# Altium project Driver.PrjPcb
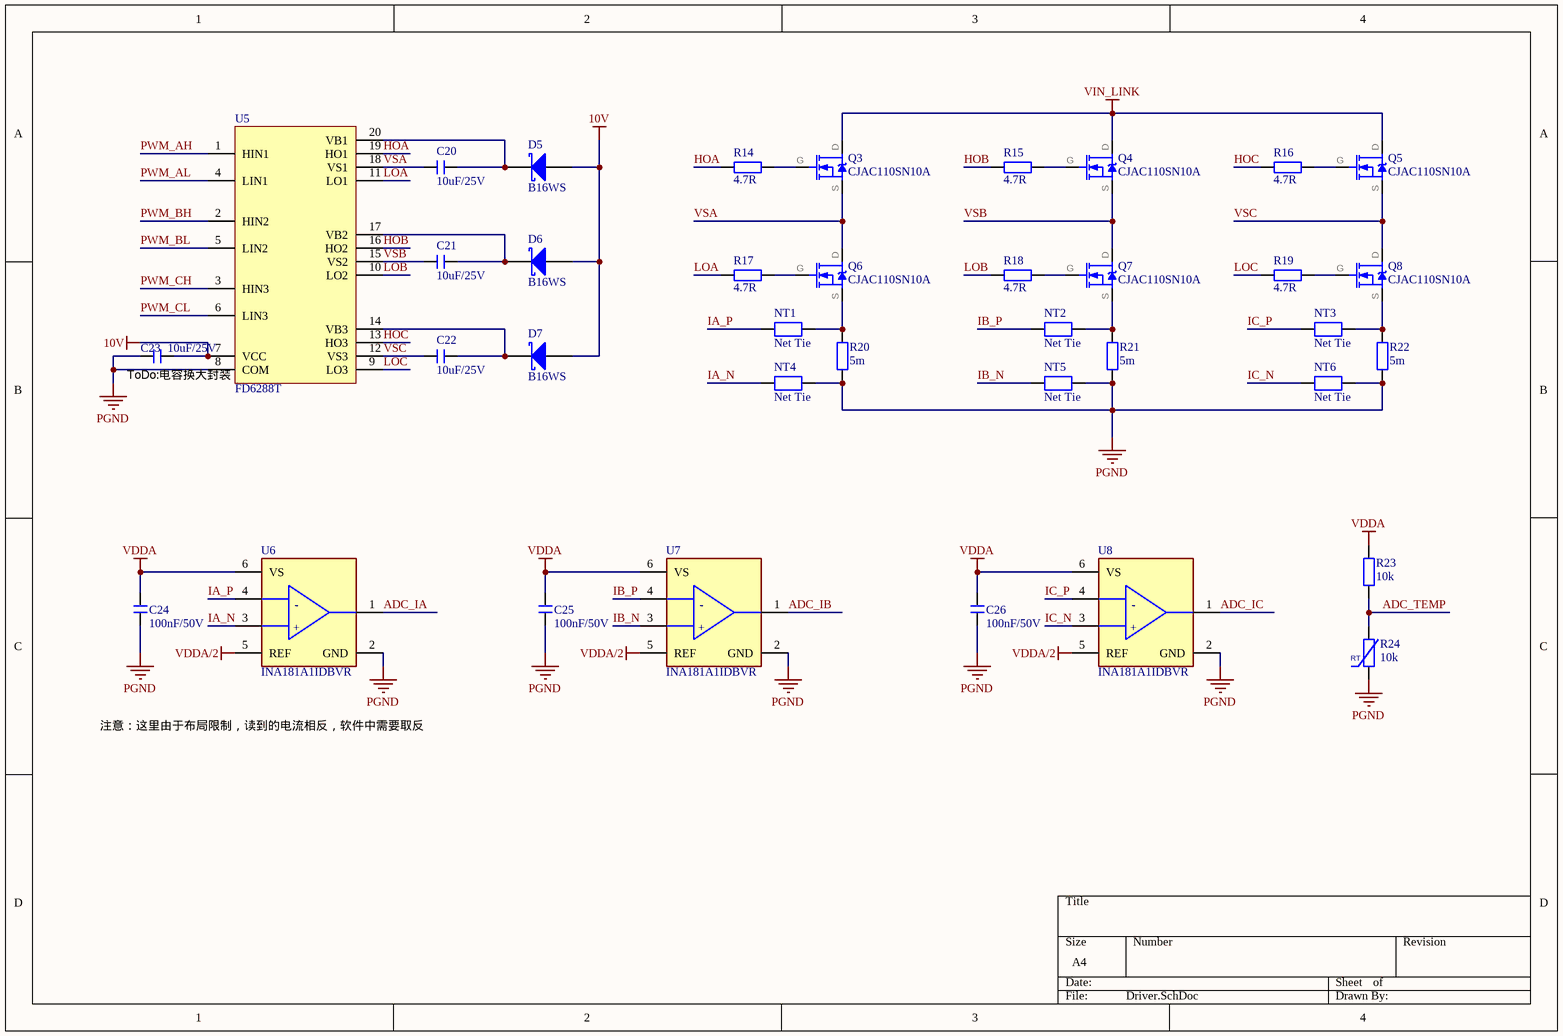
[diagram p0: Driver.SchDoc]
3 sheets, 93 parts. Net scope: global (net labels, ports and power ports of the same name join across sheets).
Board file: Driver.PcbDoc
Sheets:
  Driver.SchDoc
  Power.SchDoc
  Interface.SchDoc

## Sheet Driver.SchDoc
size A4; SheetNumber: 1; SheetTotal: 3

### Parts
C20  10uF/25V  [Capacitor_0603_SMD]
C21  10uF/25V  [Capacitor_0603_SMD]
C22  10uF/25V  [Capacitor_0603_SMD]
C23  10uF/25V  [Capacitor_0603_SMD]
C24  100nF/50V  [Capacitor_0402_SMD]
C25  100nF/50V  [Capacitor_0402_SMD]
C26  100nF/50V  [Capacitor_0402_SMD]
D5  B16WS  [SOD-323]
D6  B16WS  [SOD-323]
D7  B16WS  [SOD-323]
NT1  Net Tie  [Net Tie 10mil]  (net tie, no BOM)
NT2  Net Tie  [Net Tie 10mil]  (net tie, no BOM)
NT3  Net Tie  [Net Tie 10mil]  (net tie, no BOM)
NT4  Net Tie  [Net Tie 10mil]  (net tie, no BOM)
NT5  Net Tie  [Net Tie 10mil]  (net tie, no BOM)
NT6  Net Tie  [Net Tie 10mil]  (net tie, no BOM)
Q3  CJAC110SN10A  [PDFNWB5×6-8L]
Q4  CJAC110SN10A  [PDFNWB5×6-8L]
Q5  CJAC110SN10A  [PDFNWB5×6-8L]
Q6  CJAC110SN10A  [PDFNWB5×6-8L]
Q7  CJAC110SN10A  [PDFNWB5×6-8L]
Q8  CJAC110SN10A  [PDFNWB5×6-8L]
R14  4.7R  [Resistor_0603_SMD]
R15  4.7R  [Resistor_0603_SMD]
R16  4.7R  [Resistor_0603_SMD]
R17  4.7R  [Resistor_0603_SMD]
R18  4.7R  [Resistor_0603_SMD]
R19  4.7R  [Resistor_0603_SMD]
R20  5m  [Resistor_2512_SMD]
R21  5m  [Resistor_2512_SMD]
R22  5m  [Resistor_2512_SMD]
R23  10k  [Resistor_0402_SMD]
R24  10k  [Resistor_0402_SMD]
U5  FD6288T  [TSSOP20_L]
U6  INA181A1IDBVR  [FP-DBV0006A-IPC_A]
U7  INA181A1IDBVR  [FP-DBV0006A-IPC_A]
U8  INA181A1IDBVR  [FP-DBV0006A-IPC_A]

### Nets
10V: C23.2 D5.1(A) D6.1(A) D7.1(A) U5.7(VCC)
PGND: C23.1 C24.1 C25.1 C26.1 NT4.2 NT5.2 NT6.2 R20.1 R21.1 R22.1 R24.1 U5.8(COM) U6.2(GND) U7.2(GND) U8.2(GND)
VDDA: C24.2 C25.2 C26.2 R23.2 U6.6(VS) U7.6(VS) U8.6(VS)
VDDA/2: U6.5(REF) U7.5(REF) U8.5(REF)
VIN_LINK: Q3.D Q4.D Q5.D
ADC_IA: U6.1(OUT)
ADC_IB: U7.1(OUT)
ADC_IC: U8.1(OUT)
ADC_TEMP: R23.1 R24.2
HOA: R14.2 U5.19(HO1)
HOB: R15.2 U5.16(HO2)
HOC: R16.2 U5.13(HO3)
IA_N: NT4.1 U6.3(IN+)
IA_P: NT1.1 U6.4(IN-)
IB_N: NT5.1 U7.3(IN+)
IB_P: NT2.1 U7.4(IN-)
IC_N: NT6.1 U8.3(IN+)
IC_P: NT3.1 U8.4(IN-)
LOA: R17.2 U5.11(LO1)
LOB: R18.2 U5.10(LO2)
LOC: R19.2 U5.9(LO3)
PWM_AH: U5.1(HIN1)
PWM_AL: U5.4(LIN1)
PWM_BH: U5.2(HIN2)
PWM_BL: U5.5(LIN2)
PWM_CH: U5.3(HIN3)
PWM_CL: U5.6(LIN3)
VSA: C20.1 Q3.S Q6.D U5.18(VS1)
VSB: C21.1 Q4.S Q7.D U5.15(VS2)
VSC: C22.1 Q5.S Q8.D U5.12(VS3)
NetC20_2: C20.2 D5.2(K) U5.20(VB1)
NetC21_2: C21.2 D6.2(K) U5.17(VB2)
NetC22_2: C22.2 D7.2(K) U5.14(VB3)
NetNT1_2: NT1.2 Q6.S R20.2
NetNT2_2: NT2.2 Q7.S R21.2
NetNT3_2: NT3.2 Q8.S R22.2
NetQ3_G: Q3.G R14.1
NetQ4_G: Q4.G R15.1
NetQ5_G: Q5.G R16.1
NetQ6_G: Q6.G R17.1
NetQ7_G: Q7.G R18.1
NetQ8_G: Q8.G R19.1

### Notes on the sheet
- (near C23) ToDo:电容换大封装
- 注意：这里由于布局限制，读到的电流相反，软件中需要取反
- (in symbol CMP-04895-000055-1) -; +

### Library data of the parts
C20-C26 = C: 无极性贴片电容; 版权归属: 源创客; BOM名称: 无极性贴片电容; 学习资源: www.ooocke.com
D5-D7 = SS14: 肖特基二极管; 属性: 40V/1A; 联系卖家，免费查找封装: 唯一出售店铺网址https://shop463601444.taobao.com; BOM名称: 肖特基二极管
Q3-Q8 = CJAC110SN10A: 110A 3.4mΩ@10V N-Channel Power MOSFET
R14-R22 = R: 贴片电阻; 版权归属: 源创客; BOM名称: 贴片电阻; 学习资源: www.ooocke.com
R23 = R: 贴片电阻; 联系卖家，免费查找封装: 唯一出售店铺网址https://shop463601444.taobao.com; BOM名称: 贴片电阻
R24 = RT: 热敏电阻; BOM名称: 压敏电阻; 联系卖家，免费查找封装: 唯一出售店铺网址https://shop463601444.taobao.com
U5 = FD6288T: 三相250V栅极驱动器
U6-U8 = CMP-04895-000055-1: IC CURR SENSE 1 CIRCUIT SOT23-6; Manufacturer: Texas Instruments; Input Offset Voltage: 0.1mV; Min Supply Voltage: 2.7V; Max Junction Temp: +150°C; Voltage Gain: 0.02V/mV; Number Of Channels: 1; Standoff Height: 0mm; Input Bias Current: 75uA; Nominal Supply Current: 195uA; Bandwidth: 350kHz; Output Current Per Channel: 8mA; Max Supply Voltage: 5.5V; Device Class L1: Integrated Circuits (ICs); Ambient Temperature Range High: +125°C; Device Class L3: Instrumentation; Temperature: -40°C to +125°C; ComponentLink2Description: Datasheet; RoHS: TRUE; Category: IC; Manufacturer Part Number: INA181A1IDBVR; Mouser Description: 26V bi-directional current sense amplifier for cost-sensitive systems 6-SOT-23 -40 to 125; Package: DBV0006A; Automotive: No; Height: 1.45mm; Temperature Range Low: -40°C; Lead Free: Yes; Device Class L2: Linear ICs; Digikey Description: IC CURR SENSE 1 CIRCUIT SOT23-6; ComponentLink2URL: http://www.ti.com/lit/ds/symlink/ina181.pdf; Ambient Temperature Range Low: -40°C; Octopart: https://octopart.com/ina181a1idbvr-texas+instruments-81856289; Temperature Range High: +125°C

## Sheet Power.SchDoc
size A4; SheetNumber: 2; SheetTotal: 3
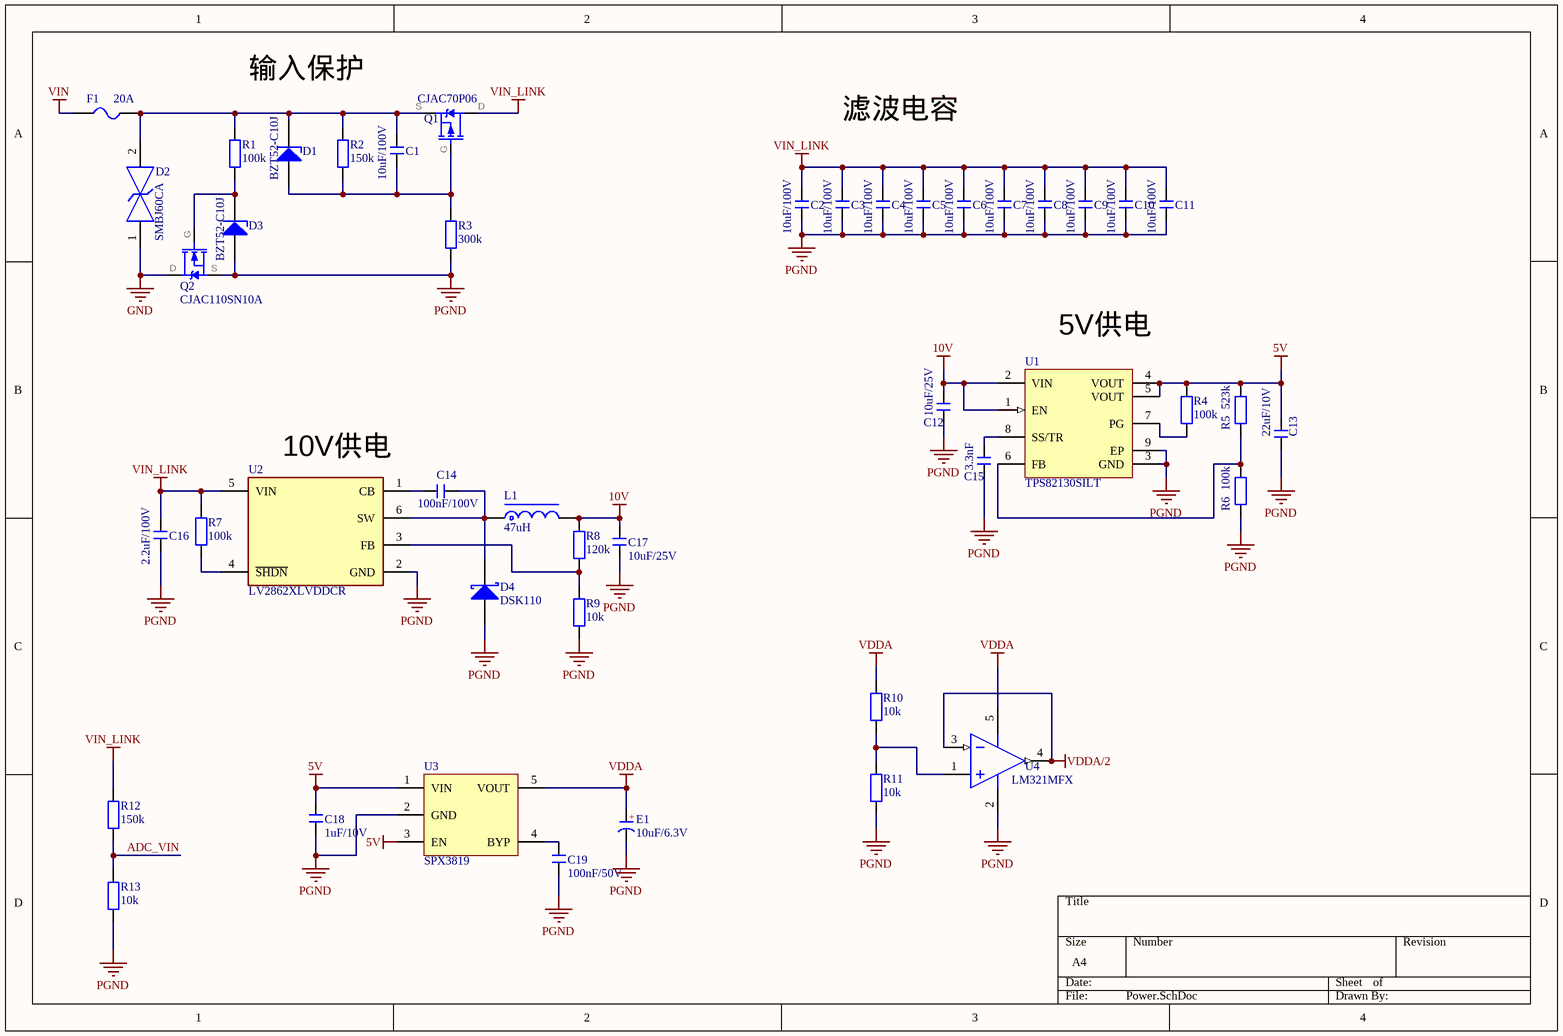
[diagram p1: Power.SchDoc]

### Parts
C1  10uF/100V  [Capacitor_1206_SMD]
C2  10uF/100V  [Capacitor_1206_SMD]
C3  10uF/100V  [Capacitor_1206_SMD]
C4  10uF/100V  [Capacitor_1206_SMD]
C5  10uF/100V  [Capacitor_1206_SMD]
C6  10uF/100V  [Capacitor_1206_SMD]
C7  10uF/100V  [Capacitor_1206_SMD]
C8  10uF/100V  [Capacitor_1206_SMD]
C9  10uF/100V  [Capacitor_1206_SMD]
C10  10uF/100V  [Capacitor_1206_SMD]
C11  10uF/100V  [Capacitor_1206_SMD]
C12  10uF/25V  [Capacitor_0603_SMD]
C13  22uF/10V  [Capacitor_0603_SMD]
C14  100nF/100V  [Capacitor_0603_SMD]
C15  3.3nF  [Capacitor_0402_SMD]
C16  2.2uF/100V  [Capacitor_1206_SMD]
C17  10uF/25V  [Capacitor_0603_SMD]
C18  1uF/10V  [Capacitor_0402_SMD]
C19  100nF/50V  [Capacitor_0402_SMD]
D1  BZT52-C10J  [SOD-123FL]
D2  SMBJ60CA  [FP-SMBJ-CA-MFG]
D3  BZT52-C10J  [SOD-123FL]
D4  DSK110  [SOD-123FL]
E1  10uF/6.3V  [Tantalum_Capacitor_0805_SMD]
F1  20A  [FU 1808]
L1  47uH  [Molded_Inductor_0530]
Q1  CJAC70P06  [PDFNWB5×6-8L]
Q2  CJAC110SN10A  [PDFNWB5×6-8L]
R1  100k  [Resistor_0402_SMD]
R2  150k  [Resistor_0402_SMD]
R3  300k  [Resistor_0402_SMD]
R4  100k  [Resistor_0402_SMD]
R5  523k  [Resistor_0402_SMD]
R6  100k  [Resistor_0402_SMD]
R7  100k  [Resistor_0402_SMD]
R8  120k  [Resistor_0402_SMD]
R9  10k  [Resistor_0402_SMD]
R10  10k  [Resistor_0402_SMD]
R11  10k  [Resistor_0402_SMD]
R12  150k  [Resistor_0402_SMD]
R13  10k  [Resistor_0402_SMD]
U1  TPS82130SILT  [SIL0008D_V]
U2  LV2862XLVDDCR  [FP-DDC0006A-MFG]
U3  SPX3819  [SOT23-5L]
U4  LM321MFX  [DBV0005A_L]

### Nets
5V: C13.2 C18.2 R4.2 R5.2 U1.4(VOUT) U1.5(VOUT) U3.1(VIN) U3.3(EN)
10V: C12.1 C17.1 L1.2 R8.2 U1.1(EN) U1.2(VIN)
GND: D2.1 Q2.D
PGND: C2.1 C3.1 C4.1 C5.1 C6.1 C7.1 C8.1 C9.1 C10.1 C11.1 C12.2 C13.1 C15.1 C16.2 C17.2 C18.1 C19.1 D3.1(A) D4.1(A) E1.2(K) Q2.S R3.1 R6.1 R9.2 R11.2 R13.1 U1.3(GND) U1.9(EP) U2.2(GND) U3.2(GND) U4.2(V-)
VDDA: E1.1(A) R10.1 U3.5(VOUT) U4.5(V+)
VDDA/2: U4.3(IN-) U4.4(OUT)
VIN: F1.1
VIN_LINK: C2.2 C3.2 C4.2 C5.2 C6.2 C7.2 C8.2 C9.2 C10.2 C11.2 C16.1 Q1.D R7.2 R12.2 U2.5(VIN)
ADC_VIN: R12.1 R13.2
NetC1_1: C1.1 D1.1(A) Q1.G R2.1 R3.2
NetC1_2: C1.2 D1.2(K) D2.2 F1.2 Q1.S R1.2 R2.2
NetC14_1: C14.1 U2.1(CB)
NetC14_2: C14.2 D4.2(K) L1.1 U2.6(SW)
NetC15_2: C15.2 U1.8(SS/TR)
NetC19_2: C19.2 U3.4(BYP)
NetD3_2: D3.2(K) Q2.G R1.1
NetR4_1: R4.1 U1.7(PG)
NetR5_1: R5.1 R6.2 U1.6(FB)
NetR7_1: R7.1 U2.4(~{SHDN})
NetR8_1: R8.1 R9.1 U2.3(FB)
NetR10_2: R10.2 R11.1 U4.1(IN+)

### Notes on the sheet
- 输入保护
- 滤波电容
- (near U1) 5V供电
- (near U2) 10V供电
- (in symbol C-CD) +

### Library data of the parts
C1-C19 = C: 无极性贴片电容; 版权归属: 源创客; BOM名称: 无极性贴片电容; 学习资源: www.ooocke.com
D1 D3 = 稳压二极管: Zener Diode; 联系卖家，免费查找封装: 唯一出售店铺网址https://shop463601444.taobao.com
D2 = CMP-08607-000060-1: TVS DIODE 60V DO214AA; Manufacturer Part Number: SMBJ48CA; Manufacturer: Littelfuse Inc; Number Of Channels: 1; Peak Pulse Current: 7.8A; Max Junction Temp: +150°C; Clamping Voltage: 77.4V; Breakdown Voltage: 53.3V; Direction: Bidirectional; Peak Pulse Power: 600W; Reverse Standoff Voltage: 48V; Temperature: -65°C to +150°C; ComponentLink2Description: Datasheet; Height: 2.61mm; ComponentLink2URL: https://www.littelfuse.com/~/media/electronics/datasheets/tvs_diodes/littelfuse_tvs_diode_smbj_datasheet.pdf.pdf; Temperature Range Low: -65°C; Automotive: No; RoHS: TRUE; Device Class L3: unset; Mouser Description: In a Pack of 25, Littelfuse SMBJ48CA, Bi-Directional TVS Diode, 600W, 2-Pin DO-214AA; Temperature Range High: +150°C; Octopart: https://octopart.com/smbj48ca-littelfuse-350748; Lead Free: Yes; Device Class L2: TVS Diodes; Digikey Description: TVS DIODE 48V 77.4V DO214AA; Device Class L1: Circuit Protection; Category: Diode; Package: SMBJ-CA
D4 = SS14: as D5 on sheet Driver; BOM名称: 肖特基二极管
E1 = C-CD: 贴片钽电容; 版权归属: 源创客; BOM名称: 贴片钽电容; 学习资源: www.ooocke.com
F1 = FU: 贴片保险丝; 版权归属: 源创客; BOM名称: 贴片保险丝; 学习资源: www.ooocke.com
L1 = L-CD: 贴片功率电感; BOM名称: 功率电感; 版权归属: 源创客; 学习资源: www.ooocke.com
Q1 = CJAC70P06: -70A 7.6mΩ@-10V P-Channel Power MOSFET
Q2 = CJAC110SN10A: 110A 3.4mΩ@10V N-Channel Power MOSFET
R1-R4 R6-R13 = R: 贴片电阻; 版权归属: 源创客; BOM名称: 贴片电阻; 学习资源: www.ooocke.com
R5 = R: 贴片电阻
U1 = CMP-2000-07569-1: Step-Down Converter MicroSiP(TM) Module with Integrated Inductor, 3 A, 3 to 17 V, -40 to 125 degC, 8-Pin uSiP (SIL), Tape and Reel; Manufacturer: Texas Instruments; Quiescent Current: 20uA; Output Voltage: 5V; Output Current: 3A; Max Input Voltage: 17V; Switching Frequency: 2MHz; Min Output Voltage: 900mV; Number of Outputs: 1; Min Input Voltage: 3V; Datasheet URL: http://www.ti.com/lit/ds/symlink/tps82130.pdf; Packaging: CutTape; Datasheet Version: Rev. C, 01/2017; Package Reference: SIL0008D; Case/Package: SMD/SMT; Manufacturer URL: http://www.ti.com/; Length: 0.12inch; Lead Free: LeadFree; Mount: SurfaceMount; Number of Pins: 8; Package Description: 8-Pin Single In-line Package, Body 3 x 2.8 mm, Pitch 0.65 mm; Max Output Voltage: 5V; Mounting Technology: SurfaceMount; Height: 0.06inch; Max Operating Temperature: 125degC; Width: 0.11inch; Min Operating Temperature: -40degC; Voltage - Output 1: 5V; RoHSCompliant: True; REACH SVHC: NoSVHC; Max Output Current: 3A
U2 = CMP-04918-000583-1: Switching Voltage Regulators 4.5-V to 60-V, 600-mA buck converter in ultra-small SOT23 package 6-SOT-23-THIN -40 to 125
U3 = SPX3819: 500mA Low-Noise LDO Voltage Regulator
U4 = CMP-0055-01337-3: Low Power Single Op Amp, 5-pin SOT-23; Manufacturer: Texas Instruments; PowerWise: N; CompType: Amplifiers; PackageTopMarking: A63A*XTT; ComponentLink1Description: Datasheet URL; PackageDescription: Molded SOT-23, .115 x .063 x .040 in Body, 5 Lead, .0375 in Pitch; PinCount: 5; ComponentLink1URL: http://www.ti.com/general/docs/lit/getliterature.tsp?genericPartNumber=LM321&fileType=pdf; RoHS: N; Package Reference: DBV0005A

## Sheet Interface.SchDoc
size A4; SheetNumber: 3; SheetTotal: 3
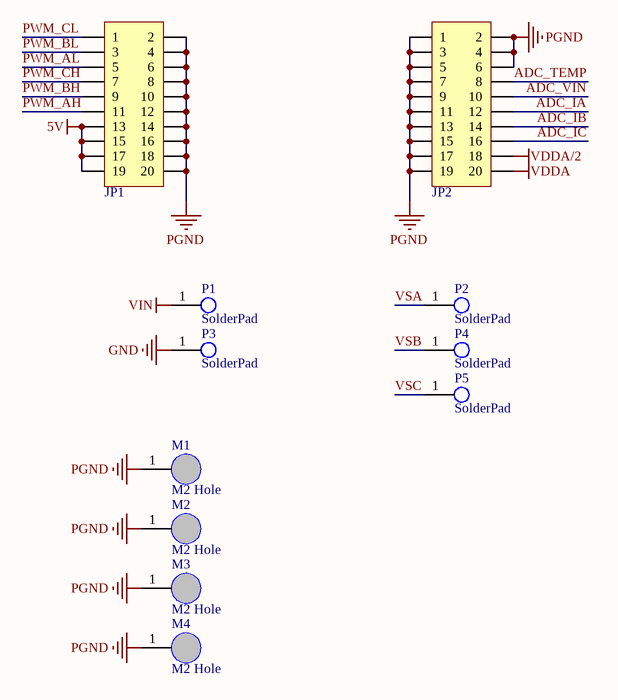
[diagram p2: Interface.SchDoc]

### Parts
JP1  Header 2X10  [HDR2.0-LI-2x10P]  (value not drawn)
JP2  Header 2X10  [HDR2.0-LI-2x10P]  (value not drawn)
M1  M2 Hole  [M2 Hole]
M2  M2 Hole  [M2 Hole]
M3  M2 Hole  [M2 Hole]
M4  M2 Hole  [M2 Hole]
P1  SolderPad  [SolderPad]
P2  SolderPad  [SolderPad]
P3  SolderPad  [SolderPad]
P4  SolderPad  [SolderPad]
P5  SolderPad  [SolderPad]

### Nets
5V: JP1.13 JP1.15 JP1.17 JP1.19
GND: P3.1(SolderPad)
PGND: JP1.2 JP1.4 JP1.6 JP1.8 JP1.10 JP1.12 JP1.14 JP1.16 JP1.18 JP1.20 JP2.1 JP2.2 JP2.3 JP2.4 JP2.5 JP2.6 JP2.7 JP2.9 JP2.11 JP2.13 JP2.15 JP2.17 JP2.19 M1.1(Hole) M2.1(Hole) M3.1(Hole) M4.1(Hole)
VDDA: JP2.20
VDDA/2: JP2.18
VIN: P1.1(SolderPad)
ADC_IA: JP2.12
ADC_IB: JP2.14
ADC_IC: JP2.16
ADC_TEMP: JP2.8
ADC_VIN: JP2.10
PWM_AH: JP1.11
PWM_AL: JP1.5
PWM_BH: JP1.9
PWM_BL: JP1.3
PWM_CH: JP1.7
PWM_CL: JP1.1
VSA: P2.1(SolderPad)
VSB: P4.1(SolderPad)
VSC: P5.1(SolderPad)

### Library data of the parts
JP1 JP2 = Header 10X2: 10*2P接插件; 封装库来自淘宝卖家 ID：黄晶宝石: 其他店铺购入均为盗版假冒封装库; 联系卖家，免费查找封装: 唯一出售店铺网址https://shop463601444.taobao.com; BOM名称: 10*2P接插件
M1-M4 = M2_hole
P1-P5 = SolderPad: 焊盘

## Nets that join several sheets
5V: Power (8 pins), Interface (JP1.13 JP1.15 JP1.17 JP1.19)
10V: Driver (5 pins), Power (6 pins)
GND: Power (D2.1 Q2.D), Interface (P3.1)
PGND: Driver (15 pins), Power (31 pins), Interface (27 pins)
VDDA: Driver (7 pins), Power (E1.1 R10.1 U3.5 U4.5), Interface (JP2.20)
VDDA/2: Driver (U6.5 U7.5 U8.5), Power (U4.3 U4.4), Interface (JP2.18)
VIN: Power (F1.1), Interface (P1.1)
VIN_LINK: Driver (Q3.D Q4.D Q5.D), Power (15 pins)
ADC_IA: Driver (U6.1), Interface (JP2.12)
ADC_IB: Driver (U7.1), Interface (JP2.14)
ADC_IC: Driver (U8.1), Interface (JP2.16)
ADC_TEMP: Driver (R23.1 R24.2), Interface (JP2.8)
ADC_VIN: Power (R12.1 R13.2), Interface (JP2.10)
PWM_AH: Driver (U5.1), Interface (JP1.11)
PWM_AL: Driver (U5.4), Interface (JP1.5)
PWM_BH: Driver (U5.2), Interface (JP1.9)
PWM_BL: Driver (U5.5), Interface (JP1.3)
PWM_CH: Driver (U5.3), Interface (JP1.7)
PWM_CL: Driver (U5.6), Interface (JP1.1)
VSA: Driver (C20.1 Q3.S Q6.D U5.18), Interface (P2.1)
VSB: Driver (C21.1 Q4.S Q7.D U5.15), Interface (P4.1)
VSC: Driver (C22.1 Q5.S Q8.D U5.12), Interface (P5.1)